# EasyEDA Pro project firefly_solarpanel.eprj

# Schematic Schematic1
Board Name: Board1; Create Date: 2026-03-13; Page Name: P1; Project Name: firefly_solarpanel; Schematic Name: Schematic1; Update Date: 2026-09-25; Company: EasyEDA.com; Page Size: A4; Version: V1.0
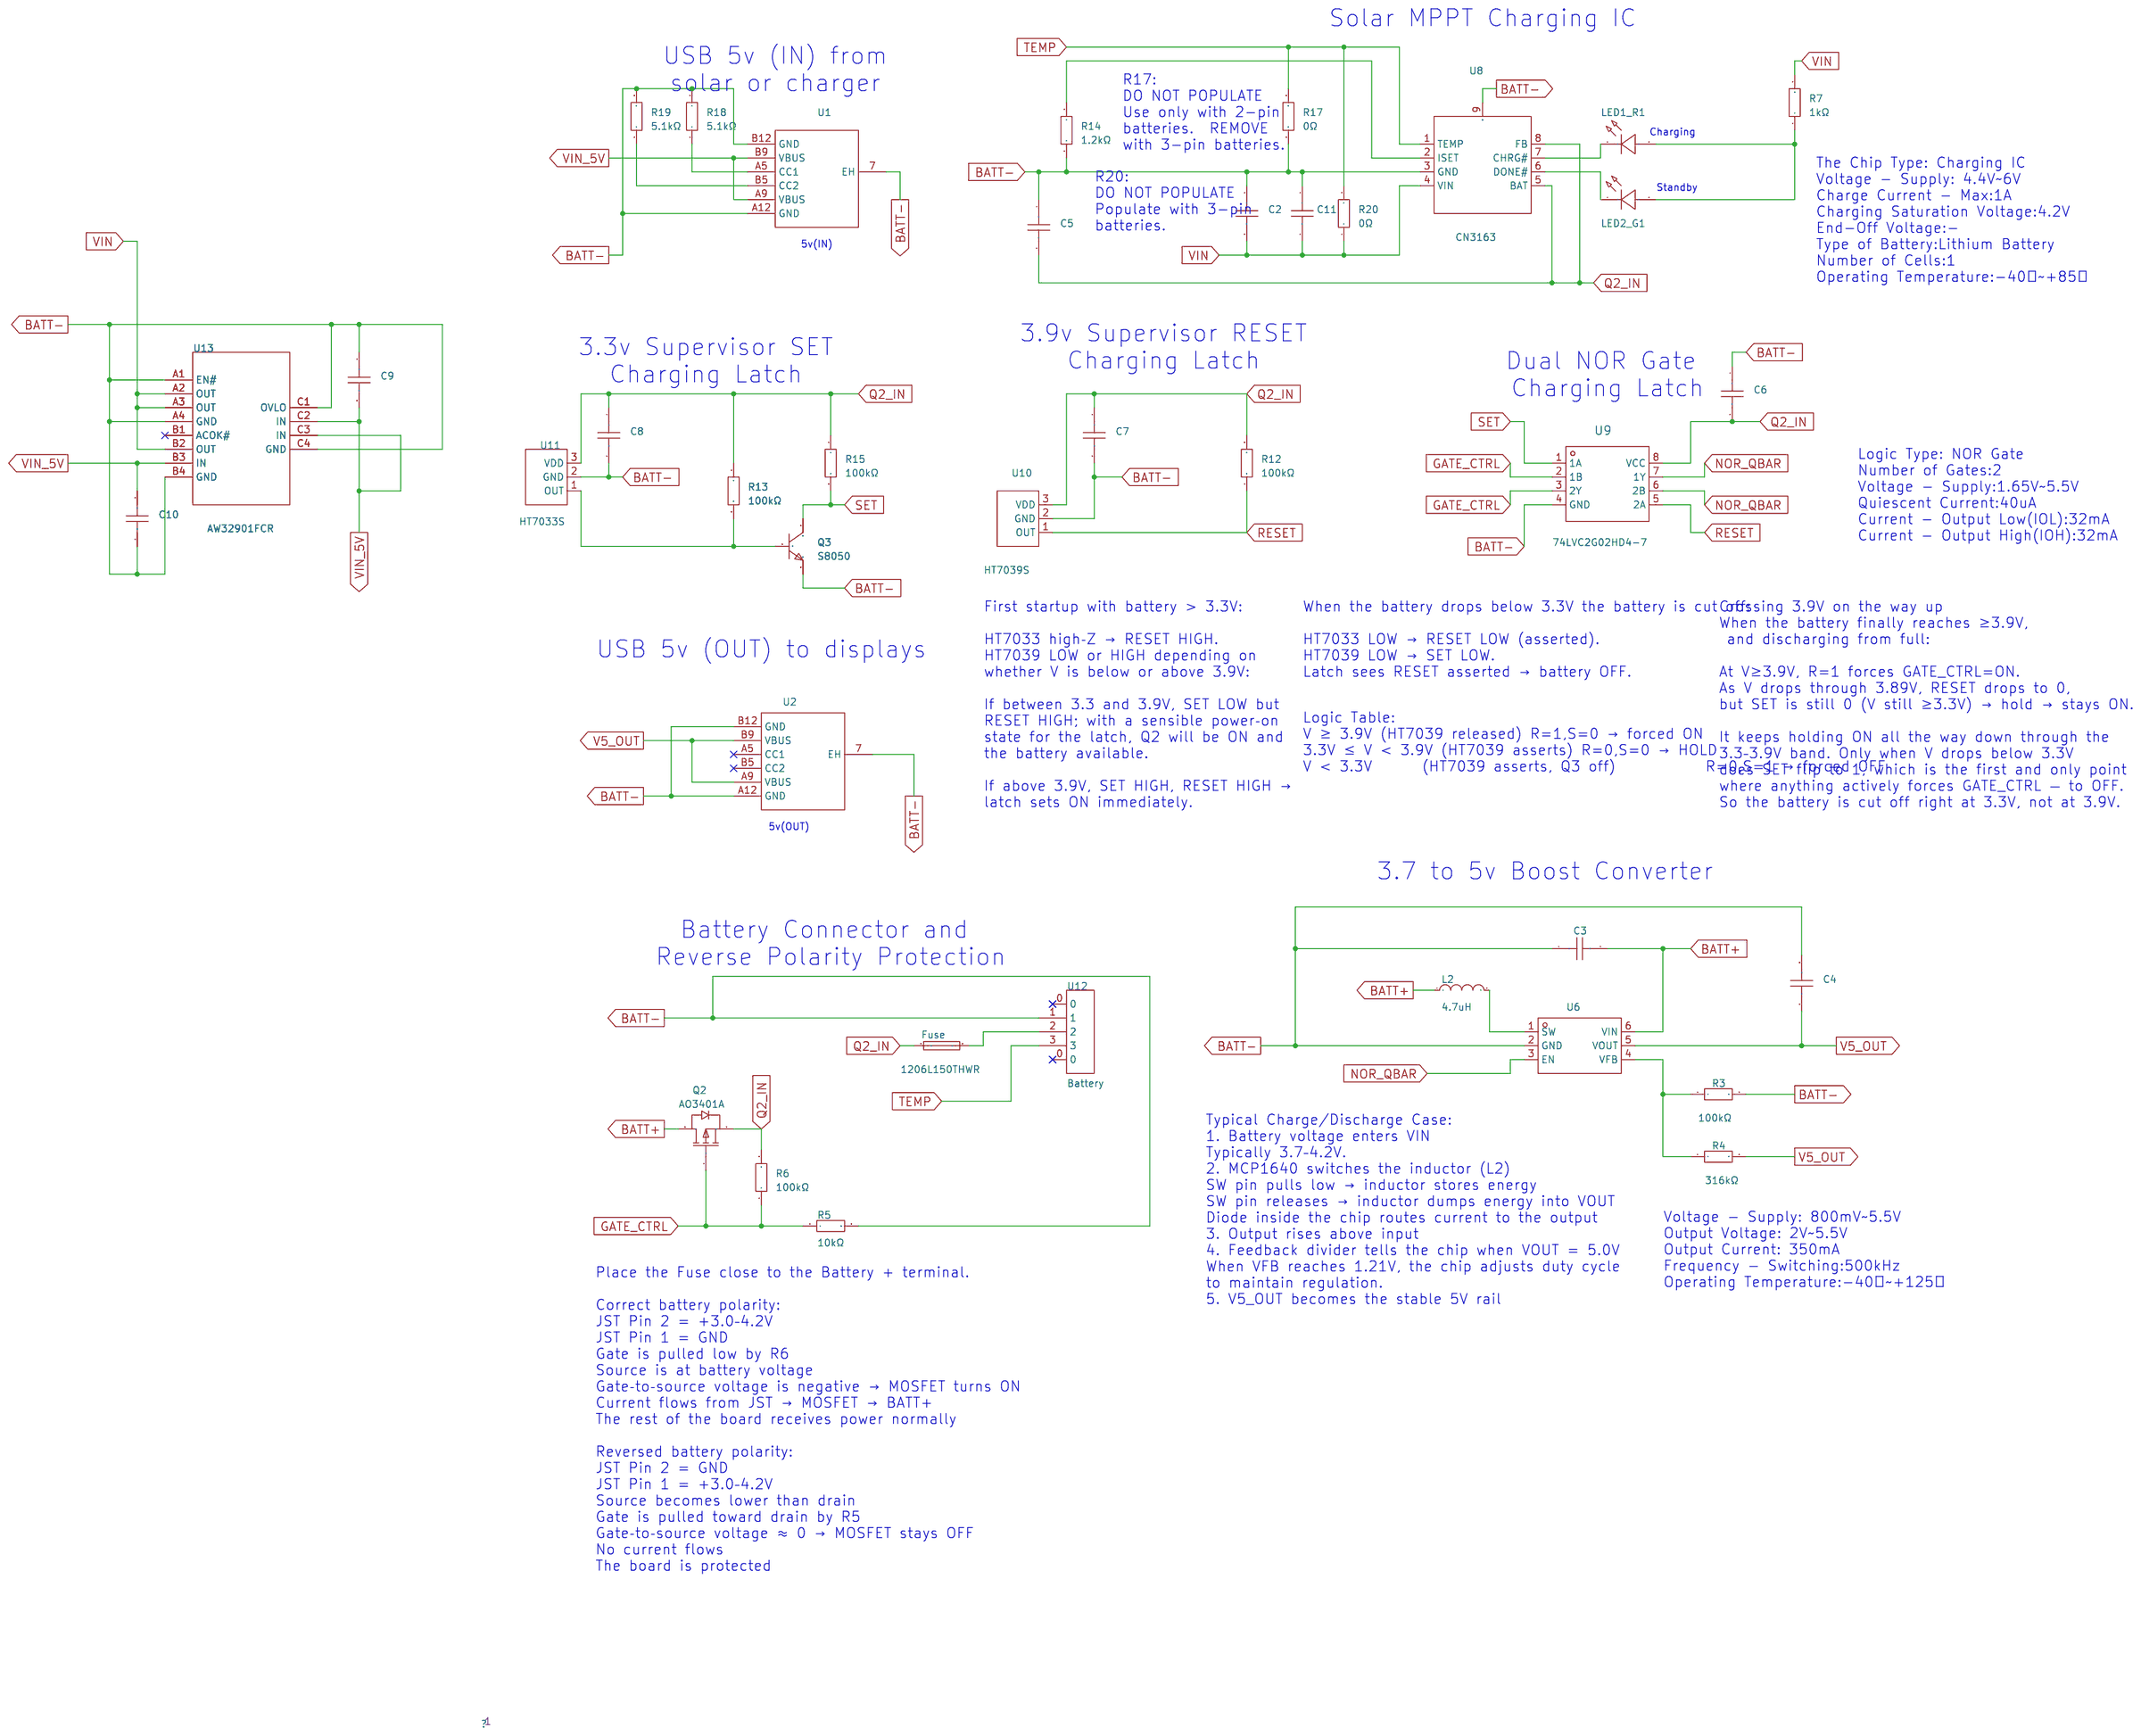
[diagram p0: schematic sheet]

## Parts
C2  1uF  [C0603]
C3  10uF  [C0603]
C4  10uF  [C0603]
C5  1uF  [C0603]
C6  1uF  [C0603]
C7  1uF  [C0603]
C8  1uF  [C0603]
C9  1uF  [C0603]
C10  1uF  [C0603]
C11  1uF  [C0603]
Fuse  1206L150THWR  [F1206]
L2  4.7uH  [L0805]
LED1_R1  XL-1608SURC-06  [LED0603-RD_RED]
LED2_G1  PSC-1608U52GC-G4  [LED0603-RD_GREEN]
Q2  AO3401A  [SOT-23_L2.9-W1.3-P1.90-LS2.4-BR]
Q3  S8050  [SOT-23-3_L2.9-W1.3-P1.90-LS2.4-BR]
R3  100kΩ  [R0603]
R4  316kΩ  [R0603]
R5  10kΩ  [R0603]
R6  100kΩ  [R0603]
R7  1kΩ  [R0603]
R12  100kΩ  [R0603]
R13  100kΩ  [R0603]
R14  1.2kΩ  [R0603]
R15  100kΩ  [R0603]
R17  0Ω  [R0603]
R18  5.1kΩ  [R0603]
R19  5.1kΩ  [R0603]
R20  0Ω  [R0603]  (no BOM)
U1  TYPE-C 6P  [TYPE-C-SMD_TYPE-C-6P_1]
U2  TYPE-C 6P  [TYPE-C-SMD_TYPE-C-6P_1]
U6  MCP1640BT-I/CHY  [SOT-23-6_L2.9-W1.6-P0.95-LS2.8-BR]
U8  CN3163  [ESOP-8_L4.9-W3.9-P1.27-LS6.0-BL-EP]
U9  74LVC2G02HD4-7  [X2-DFN2010-8_L2.0-W1.0-P0.50-BL]
U10  HT7039S  [SOT-23-3_L2.9-W1.6-P1.90-LS2.8-BR]
U11  HT7033S  [SOT-23-3_L2.9-W1.6-P1.90-LS2.8-BR]
U12  Battery  [CONN-SMD_S3B-PH-SM4-TB-LF-SN]
U13  AW32901FCR  [BGA-12_L1.8-W1.3-R3-C4-P0.40-TL]

## Library data of the parts
C2 C5-C11 = CL10A105KO8NNNC: Capacitance:1uF Tolerance:±10% Tolerance:±10% Voltage Rating:16V Temperature Coefficient:X5R; LCSC Part Name: 1uF ±10% 16V; Supplier Part: C1592; Manufacturer: SAMSUNG(三星); Supplier Footprint: 0603; JLCPCB Part Class: Extended Part; Datasheet: https://item.szlcsc.com/datasheet/CL10A105KO8NNNC/1944.html; Supplier: LCSC; Tolerance: ±10%; Voltage Rating: 16V; Temperature Coefficient: X5R
C3 C4 = CL10A106KP8NNNC: Capacitance:10uF Tolerance:±10% Tolerance:±10% Voltage Rating:10V Temperature Coefficient:X5R; LCSC Part Name: 10uF ±10% 10V; Supplier Part: C19702; Manufacturer: SAMSUNG(三星); Supplier Footprint: 0603; JLCPCB Part Class: Basic Part; Datasheet: https://item.szlcsc.com/datasheet/CL10A106KP8NNNC/20411.html; Supplier: LCSC; Tolerance: ±10%; Voltage Rating: 10V; Temperature Coefficient: X5R
Fuse = 1206L150THWR: LCSC Part Name: 8V 1.5A 1206自恢复; Supplier Part: C118413; Manufacturer: Littelfuse(美国力特); Supplier Footprint: 1206; JLCPCB Part Class: Extended Part; Datasheet: https://item.szlcsc.com/datasheet/1206L150THWR/119679.html; Supplier: LCSC; Voltage - Max: 8V; Current - Max: 100A; Hold Current: 1.5A; Trip Current: 3A; Power Dissipation: 800mW; Resistance - Initial (Ri) (Min): 40mΩ; Resistance - Post Trip (R1) (Max): 120mΩ; Time to Trip(Max): 300ms; Operating Temperature: -40℃~+85℃
L2 = CPY201209T-4R7M-NP: Inductance:4.7uH Tolerance:±20% Tolerance:±20% Current Rating:- Current - Saturation (Isat):- DC Resistance(DCR):- Q @ Frequency:- Frequency - Self Resonant:- Ratings:-; LCSC Part Name: 4.7uH ±20%; Supplier Part: C285965; Manufacturer: Chilisin(奇力新); Supplier Footprint: 0805; JLCPCB Part Class: Extended Part; Datasheet: https://item.szlcsc.com/datasheet/CPY201209T-4R7M-NP/271270.html; Supplier: LCSC; Tolerance: ±20%
LED1_R1 = XL-1608SURC-06: Lamp Holder Type:1.6mm x 0.8mm square LED Illumination Color:Red Voltage - Forward(Vf):2.3V Voltage - Forward(Vf):2.3V Power(Watts):50mW Forward Current:20mA Wavelength - Dominant:620nm~630nm Wavelength - Dominant:620nm~630nm Peak Wavelength:625nm Peak Wa; LCSC Part Name: 0603红色贴片式发光二极管; Supplier Part: C965799; Manufacturer: XINGLIGHT(成兴光); Supplier Footprint: 0603; JLCPCB Part Class: Extended Part; Datasheet: https://item.szlcsc.com/datasheet/XL-1608SURC-06/1051408.html; Supplier: LCSC; Lamp Holder Type: 1.6mm x 0.8mm square LED; Illumination Color: Red; Voltage - Forward(Vf): 2.3V; Power(Watts): 50mW; Forward Current: 20mA; Wavelength - Dominant: 620nm~630nm; Peak Wavelength: 625nm; Diode Configuration: Discrete Diode; Lens Color: Water Clear; Luminous Intensity: 225mcd; Viewing Angle: 120°; Mounting Style: Top-mount; Operating Temperature: -40℃~+85℃
LED2_G1 = PSC-1608U52GC-G4: Lamp Holder Type:- Illumination Color:Green Voltage - Forward(Vf):3.1V Voltage - Forward(Vf):3.1V Power(Watts):66mW Forward Current:10mA Wavelength - Dominant:517nm~527nm Wavelength - Dominant:517nm~527nm Peak Wavelength:- Peak Wavelength:- Diode Configur; LCSC Part Name: 钻孔1608低亮绿灯; Supplier Part: C22371297; Manufacturer: HONGLITRONIC(鸿利光电); Supplier Footprint: 0603; JLCPCB Part Class: Extended Part; Datasheet: https://item.szlcsc.com/datasheet/PSC-1608U52GC-G4/23857064.html; Supplier: LCSC; Illumination Color: Green; Voltage - Forward(Vf): 3.1V; Power(Watts): 66mW; Forward Current: 10mA; Wavelength - Dominant: 517nm~527nm; Diode Configuration: Discrete Diode; Lens Color: Water Clear; Luminous Intensity: 780mcd; Viewing Angle: 130°; Operating Temperature: -40℃~+85℃
Q2 = AO3401A_C15127: Number:1 P-Channel Drain to Source Voltage:30V Current - Continuous Drain(Id):4A RDS(on):47mΩ@10V；85mΩ@2.5V；60mΩ@4.5V Pd - Power Dissipation:- Gate Threshold Voltage (Vgs(th)):900mV Gate Charge(Qg):14nC@10V Input Capacitance(Ciss):645pF Reverse Transfer C; LCSC Part Name: 1个P沟道 耐压:30V 电流:4A; Supplier Part: C15127; Manufacturer: AOS; Supplier Footprint: SOT-23; JLCPCB Part Class: Basic Part; Datasheet: https://item.szlcsc.com/datasheet/AO3401A/15801.html; Supplier: LCSC; Number: 1 P-Channel; Drain to Source Voltage: 30V; Current - Continuous Drain(Id): 4A; RDS(on): 47mΩ@10V；85mΩ@2.5V；60mΩ@4.5V; Gate Threshold Voltage (Vgs(th)): 900mV; Gate Charge(Qg): 14nC@10V; Input Capacitance(Ciss): 645pF; Reverse Transfer Capacitance (Crss@Vds): 55pF; Output Capacitance(Coss): 80pF
Q3 = S8050_C51625776: LCSC Part Name: NPN晶体管; Supplier Part: C51625776; Manufacturer: luJing(鲁晶); Supplier Footprint: SOT-23; JLCPCB Part Class: Extended Part; Datasheet: https://item.szlcsc.com/datasheet/S8050/54282507.html; Supplier: LCSC; type: NPN; Current - Collector(Ic): 500mA; Collector - Emitter Voltage VCEO: 25V; Pd - Power Dissipation: 300mW; DC Current Gain: 400; Transition frequency(fT): 150MHz; Current - Collector Cutoff: 100nA; Vce Saturation(VCE(sat)): 600mV; Emitter-Base Voltage(Vebo): 5V; Number: 1 NPN
R3 R6 R12 R13 R15 = CR0603JA0104G: Type:Thick Film Resistors Resistance: Tolerance:±5% Tolerance:±5% Power(Watts): Overload Voltage (Max): Temperature Coefficient:±200ppm/℃ Temperature Coefficient:±200ppm/℃ Operating Temperature Range:-55℃~+125℃ Operating Temperature Range:-55℃~+125℃; LCSC Part Name: 厚膜电阻 100kΩ ±5% 100mW; Supplier Part: C101255; Manufacturer: LIZ(丽智电子); Supplier Footprint: 0603; JLCPCB Part Class: Extended Part; Datasheet: https://atta.szlcsc.com/upload/public/pdf/source/20180403/C189438_6D658388CC7843F35BBC9018D03F0B8E.pdf; Supplier: LCSC; Type: Thick Film Resistors; Tolerance: ±5%; Temperature Coefficient: ±200ppm/℃; Operating Temperature Range: -55℃~+125℃
R4 = 0603WAF3163T5E: Type:Thick Film Resistor Resistance:316kΩ Tolerance:±1% Tolerance:±1% Power(Watts):100mW Voltage-Supply(Max):75V Temperature Coefficient:±100ppm/℃ Temperature Coefficient:±100ppm/℃ Operating Temperature:-55℃~+155℃ Operating Temperature:-55℃~+155℃; LCSC Part Name: 316kΩ ±1% 100mW 厚膜电阻; Supplier Part: C25814; Manufacturer: UNI-ROYAL(厚声); Supplier Footprint: 0603; JLCPCB Part Class: Extended Part; Datasheet: https://item.szlcsc.com/datasheet/0603WAF3163T5E/26557.html; Supplier: LCSC; Type: Thick Film Resistor; Tolerance: ±1%; Power(Watts): 100mW; Voltage-Supply(Max): 75V; Temperature Coefficient: ±100ppm/℃; Operating Temperature: -55℃~+155℃
R5 = HRC0603J103 ENTN: Type:Thick Film Resistor Resistance:10kΩ Tolerance:±5% Tolerance:±5% Power(Watts):100mW Voltage-Supply(Max):50V Temperature Coefficient:±100ppm/℃ Temperature Coefficient:±100ppm/℃ Operating Temperature:-55℃~+155℃ Operating Temperature:-55℃~+155℃; LCSC Part Name: 厚膜电阻; Supplier Part: C54920960; Manufacturer: HC(华橙熊猫); Supplier Footprint: 0603; JLCPCB Part Class: Extended Part; Datasheet: https://item.szlcsc.com/datasheet/HRC0603J103%2520ENTN/58459688.html; Supplier: LCSC; Type: Thick Film Resistor; Tolerance: ±5%; Power(Watts): 100mW; Voltage-Supply(Max): 50V; Temperature Coefficient: ±100ppm/℃; Operating Temperature: -55℃~+155℃
R7 = FRC0603J102 TS: Type:Thick Film Resistor Resistance:1kΩ Tolerance:±5% Tolerance:±5% Power(Watts):100mW Voltage-Supply(Max):75V Temperature Coefficient:±100ppm/℃ Temperature Coefficient:±100ppm/℃ Operating Temperature:-55℃~+155℃ Operating Temperature:-55℃~+155℃; LCSC Part Name: 1kΩ ±5% 100mW 厚膜电阻; Supplier Part: C2907113; Manufacturer: FOJAN(富捷); Supplier Footprint: 0603; JLCPCB Part Class: Extended Part; Datasheet: https://item.szlcsc.com/datasheet/FRC0603J102%2520TS/3180626.html; Supplier: LCSC; Type: Thick Film Resistor; Tolerance: ±5%; Power(Watts): 100mW; Voltage-Supply(Max): 75V; Temperature Coefficient: ±100ppm/℃; Operating Temperature: -55℃~+155℃
R14 = FRC0603J122 TS: Type:Thick Film Resistor Resistance:1.2kΩ Tolerance:±5% Tolerance:±5% Power(Watts):100mW Voltage-Supply(Max):75V Temperature Coefficient:±100ppm/℃ Temperature Coefficient:±100ppm/℃ Operating Temperature:-55℃~+155℃ Operating Temperature:-55℃~+155℃; LCSC Part Name: 1.2kΩ ±5% 100mW 厚膜电阻; Supplier Part: C2907081; Manufacturer: FOJAN(富捷); Supplier Footprint: 0603; JLCPCB Part Class: Extended Part; Supplier: LCSC; Type: Thick Film Resistor; Tolerance: ±5%; Power(Watts): 100mW; Voltage-Supply(Max): 75V; Temperature Coefficient: ±100ppm/℃; Operating Temperature: -55℃~+155℃
R17 R20 = HRC0603J000 ENTN: Type:Thick Film Resistor Resistance:0Ω Tolerance:±5% Tolerance:±5% Power(Watts):100mW Voltage-Supply(Max):50V Temperature Coefficient:±400ppm/℃ Temperature Coefficient:±400ppm/℃ Operating Temperature:-55℃~+155℃ Operating Temperature:-55℃~+155℃; LCSC Part Name: 厚膜电阻 0Ω ±5% 100mW; Supplier Part: C54920957; Manufacturer: HC(华橙熊猫); Supplier Footprint: 0603; JLCPCB Part Class: Extended Part; Datasheet: https://item.szlcsc.com/datasheet/HRC0603J000%2520ENTN/58459685.html; Supplier: LCSC; Type: Thick Film Resistor; Tolerance: ±5%; Power(Watts): 100mW; Voltage-Supply(Max): 50V; Temperature Coefficient: ±400ppm/℃; Operating Temperature: -55℃~+155℃
R18 R19 = 0603WAF5101T5E: Type:Thick Film Resistor Resistance:5.1kΩ Tolerance:±1% Tolerance:±1% Power(Watts):100mW Voltage-Supply(Max):75V Temperature Coefficient:±100ppm/℃ Temperature Coefficient:±100ppm/℃ Operating Temperature:-55℃~+155℃ Operating Temperature:-55℃~+155℃; LCSC Part Name: 厚膜电阻 5.1kΩ ±1%; Supplier Part: C23186; Manufacturer: UNI-ROYAL(厚声); Supplier Footprint: 0603; JLCPCB Part Class: Basic Part; Datasheet: https://item.szlcsc.com/datasheet/0603WAF5101T5E/23913.html; Supplier: LCSC; Type: Thick Film Resistor; Tolerance: ±1%; Power(Watts): 100mW; Voltage-Supply(Max): 75V; Temperature Coefficient: ±100ppm/℃; Operating Temperature: -55℃~+155℃
U1 U2 = TYPE-C 6P: Connector Type:Type-C Protocol Standard:- Gender:Female Mounting Type:Surface Mount, Right Angle Number of Contacts:6P Number of Ports:1 Current Rating-Power:3A Voltage Rating:5V Connect-Disconnect Life:3,000 Cycles Supplementary Features:- Center Height:; LCSC Part Name: 6P卧贴母座; Supplier Part: C456012; Manufacturer: SHOU HAN(首韩); Supplier Footprint: SMD; JLCPCB Part Class: Extended Part; Datasheet: https://item.szlcsc.com/datasheet/TYPE-C%25206P/458819.html; Supplier: LCSC; Connector Type: Type-C; Gender: Female; Mounting Type: Surface Mount, Right Angle; Number of Contacts: 6P; Number of Ports: 1; Current Rating-Power: 3A; Voltage Rating: 5V; Connect-Disconnect Life: 3,000 Cycles; Detection color: Black; Operating Temperature: -40℃~+85℃
U6 = MCP1640BT-I/CHY: LCSC Part Name: 升压型 350mA 800mV~5.5V; Supplier Part: C478087; Manufacturer: MICROCHIP(美国微芯); Supplier Footprint: SOT-23-6; JLCPCB Part Class: Extended Part; Datasheet: https://item.szlcsc.com/datasheet/MCP1640BT-I%252FCHY/485396.html; Supplier: LCSC; Function: Boost; Voltage - Supply: 800mV~5.5V; Output Voltage: 2V~5.5V; Output Current: 350mA; Frequency - Switching: 500kHz; Operating Temperature: -40℃~+125℃@(TJ); Synchronous Rectifier: Yes; Number of Outputs: 1; Topology: Boost; Quiescent Current: 19uA; Switch tube (built-in/external): Built-in; Output Type: Adjustable; Features: Light load efficient mode；Overcurrent Protection；Load disconnect
U8 = CN3163: LCSC Part Name: 可用太阳能板供电的锂电池充电管理芯片; Supplier Part: C559031; Manufacturer: CONSONANCE(上海如韵); Supplier Footprint: ESOP-8; JLCPCB Part Class: Extended Part; Datasheet: https://item.szlcsc.com/datasheet/CN3163/582671.html; Supplier: LCSC; The Chip Type: Charging IC; Voltage - Supply: 4.4V~6V; Charge Current - Max: 1A; Charging Saturation Voltage: 4.2V; Type of Battery: Lithium Battery; Number of Cells: 1; Operating Temperature: -40℃~+85℃; Battery Temperature Detection: Support; Supply Current (Iq): 3uA
U9 = 74LVC2G02HD4-7: Logic Type:NOR Gate Number of Channels:2 Voltage - Supply:1.65V~5.5V Voltage - Supply:1.65V~5.5V Quiescent Current:40uA Current - Output Low(IOL):32mA Current - Output High(IOH):32mA Input Logic Level - High:- Input Logic Level - High:- Input Logic Level; LCSC Part Name: 双2输入或非门; Supplier Part: C842640; Manufacturer: DIODES(美台); Supplier Footprint: X2-DFN2010-8; JLCPCB Part Class: Extended Part; Datasheet: https://item.szlcsc.com/datasheet/74LVC2G02HD4-7/900971.html; Supplier: LCSC; Logic Type: NOR Gate; Number of Channels: 2; Voltage - Supply: 1.65V~5.5V; Quiescent Current: 40uA; Current - Output Low(IOL): 32mA; Current - Output High(IOH): 32mA; Series: 74LVC Series; Propagation Delay: 5.5ns@5V,50pF; Operating Temperature: -40℃~+125℃; Input Number: 2; Features: Local shutdown mode
U10 = HT7039S: LCSC Part Name: 三端口低压检测器; Supplier Part: C2842952; Manufacturer: UMW(友台半导体); Supplier Footprint: SOT-23; JLCPCB Part Class: Extended Part; Datasheet: https://item.szlcsc.com/datasheet/HT7039S/3029320.html; Supplier: LCSC; ChipType: Voltage Detector; Output Type: Open Drain; Voltage - Supply: 1.5V~12V; Reset Active Level: Active Low; Threshold Voltage: 3.9V; Number of Voltages Monitored: 1; Manual Reset: No; Watchdog: No; Operating Temperature: -40℃~+85℃; Quiescent Current: 2uA
U11 = HT7033S: LCSC Part Name: 低电压检测器; Supplier Part: C2842951; Manufacturer: UMW(友台半导体); Supplier Footprint: SOT-23; JLCPCB Part Class: Extended Part; Datasheet: https://item.szlcsc.com/datasheet/HT7033S/3029319.html; Supplier: LCSC; ChipType: Voltage Detector; Output Type: Open-drain; Voltage - Supply: 1.5V~12V; Reset Active Level: Active Low; Threshold Voltage: 3.3V; Number of Voltages Monitored: 1; Operating Temperature: -40℃~+85℃; Quiescent Current: 2uA
U12 = S3B-PH-SM4-TB(LF)(SN): LCSC Part Name: 1x3P 间距:2mm 卧贴 系列:PH; Supplier Part: C265101; Manufacturer: JST; Supplier Footprint: SMD,P=2mm,卧贴; JLCPCB Part Class: Extended Part; Datasheet: https://item.szlcsc.com/datasheet/S3B-PH-SM4-TB(LF)(SN)/255472.html; Supplier: LCSC; Pins Structure: 1x3P; Pitch: 2mm; Mounting Type: Surface Mount, Right Angle; Reference Series: PH; Number of Pins: 3P; Number of Rows: 1; Number of PINs Per Row: 3; Current Rating: 2A; Contact Material: Copper Alloy; Contact Plating: Tin; Operating Temperature: -25℃~+85℃; Voltage Rating: 100V; Plastic Material: PA; Flame Retardant Rating: UL94V-0; Supplementary Features: Auxiliary Solder Pin; Color: Beige; Z-Height of the Board: 5.5mm; X-Length of Bottom Edge on Board (Spacing Line): 9.9mm; Y-Width of Bottom Edge on Board: 8.6mm
U13 = AW32901FCR: LCSC Part Name: 具备浪涌保护功能的过压保护负载开关; Supplier Part: C407920; Manufacturer: AWINIC(艾为); Supplier Footprint: FCQFN-12(1.3x1.8); JLCPCB Part Class: Extended Part; Datasheet: https://item.szlcsc.com/datasheet/AW32901FCR/397020.html; Supplier: LCSC; Type: Load Switch; Number of Channels: 1; Control Input Logic: Active Low; Voltage - Supply: 3V~28V; Maximum Continuous Current: 5A; RDS(on): 27mΩ; Features: Over temperature protection；Overvoltage protection；Under-voltage lockout；Integrated charge pump；Output discharge function; Operating Temperature	-: -40℃~+85℃

## Nets
V5_OUT: C4.1 R4.2 U2.A9(VBUS) U2.B9(VBUS) U6.5(VOUT)
VIN: C2.2 C11.2 R7.2 R20.1 U8.4(VIN) U13.A2(OUT) U13.A3(OUT) U13.B2(OUT)
VIN_5V: C9.2 C10.1 U1.A9(VBUS) U1.B9(VBUS) U13.B3(IN) U13.C2(IN) U13.C3(IN)
BATT+: C3.2 L2.1 Q2.3(D) U6.6(VIN)
BATT-: C2.1 C3.1 C4.2 C5.1 C6.1 C7.2 C8.2 C9.1 C10.2 C11.1 Q3.2(E) R3.2 R5.2 R14.1 R17.1 R18.2 R19.2 U1.7(EH) U1.A12(GND) U1.B12(GND) U2.7(EH) U2.A12(GND) U2.B12(GND) U6.2(GND) U8.3(GND) U8.9(PAD) U9.4(GND) U10.2(GND) U11.2(GND) U12.1 U13.A1(EN#) U13.A4(GND) U13.B4(GND) U13.C1(OVLO) U13.C4(GND)
GATE_CTRL: Q2.1(G) R5.1 R6.1 U9.2(1B) U9.3(2Y)
NOR_QBAR: U6.3(EN) U9.6(2B) U9.7(1Y)
Q2_IN: C5.2 C6.2 C7.1 C8.1 Fuse.1 Q2.2(S) R6.2 R12.2 R13.1 R15.1 U8.5(BAT) U8.8(FB) U9.8(VCC) U10.3(VDD) U11.3(VDD)
RESET: R12.1 U9.5(2A) U10.1(OUT)
SET: Q3.3(C) R15.2 U9.1(1A)
TEMP: R17.2 R20.2 U8.1(TEMP) U12.3
$1N3839: L2.2 U6.1(SW)
$1N3841: R3.1 R4.1 U6.4(VFB)
$1N4559: Fuse.2 U12.2
$1N8262: LED2_G1.1(K) U8.6(DONE#)
$1N12165: LED1_R1.1(K) U8.7(CHRG#)
$1N12177: LED1_R1.2(A) LED2_G1.2(A) R7.1
$1N16095: Q3.1(B) R13.2 U11.1(OUT)
$1N17264: R14.2 U8.2(ISET)
$1N25253: R18.1 U1.A5(CC1)
$1N25293: R19.1 U1.B5(CC2)

Not connected (* = marked no-connect by the designer): U2 A5(CC1)* B5(CC2)*; U12 0*; U13 B1(ACOK#)*

## Notes on the sheet
- Solar MPPT Charging IC
- USB 5v (IN) from
  solar or charger
- R17:
  DO NOT POPULATE
  Use only with 2-pin
  batteries.  REMOVE
  with 3-pin batteries.
- Charging
- The Chip Type: Charging IC
  Voltage - Supply: 4.4V~6V
  Charge Current - Max:1A
  Charging Saturation Voltage:4.2V
  End-Off Voltage:-
  Type of Battery:Lithium Battery
  Number of Cells:1
  Operating Temperature:-40℃~+85℃
- R20:
  DO NOT POPULATE
  Populate with 3-pin
  batteries.
- Standby
- 5v(IN)
- 3.9v Supervisor RESET
  Charging Latch
- 3.3v Supervisor SET
  Charging Latch
- Dual NOR Gate
  Charging Latch
- Logic Type: NOR Gate
  Number of Gates:2
  Voltage - Supply:1.65V~5.5V
  Quiescent Current:40uA
  Current - Output Low(IOL):32mA
  Current - Output High(IOH):32mA
- First startup with battery > 3.3 V:
  HT7033 high‑Z → RESET HIGH.
  HT7039 LOW or HIGH depending on
  whether V is below or above 3.9 V:
  If between 3.3 and 3.9 V, SET LOW but
  RESET HIGH; with a sensible power‑on
  state for the latch, Q2 will be ON and
  the battery available.
  If above 3.9 V, SET HIGH, RESET HIGH →
  latch sets ON immediately.
- When the battery drops below 3.3 V the battery is cut off:
  HT7033 LOW → RESET LOW (asserted).
  HT7039 LOW → SET LOW.
  Latch sees RESET asserted → battery OFF.
- Crossing 3.9 V on the way up
  When the battery finally reaches ≥3.9 V,
   and discharging from full:
  At V≥3.9V, R=1 forces GATE_CTRL=ON.
  As V drops through 3.89V, RESET drops to 0,
  but SET is still 0 (V still ≥3.3V) → hold → stays ON.
  It keeps holding ON all the way down through the
  3.3–3.9V band. Only when V drops below 3.3V
  does SET flip to 1, which is the first and only point
  where anything actively forces GATE_CTRL — to OFF.
  So the battery is cut off right at 3.3V, not at 3.9V.
- USB 5v (OUT) to displays
- Logic Table:
  V ≥ 3.9V (HT7039 released) R=1,S=0 → forced ON
  3.3V ≤ V < 3.9V (HT7039 asserts) R=0,S=0 → HOLD
  V < 3.3V	(HT7039 asserts, Q3 off)	R=0,S=1 → forced OFF
- 5v(OUT)
- 3.7 to 5v Boost Converter
- Battery Connector and
  Reverse Polarity Protection
- Typical Charge/Discharge Case:
  1. Battery voltage enters VIN
  Typically 3.7–4.2 V.
  2. MCP1640 switches the inductor (L2)
  SW pin pulls low → inductor stores energy
  SW pin releases → inductor dumps energy into VOUT
  Diode inside the chip routes current to the output
  3. Output rises above input
  4. Feedback divider tells the chip when VOUT = 5.0 V
  When VFB reaches 1.21 V, the chip adjusts duty cycle
  to maintain regulation.
  5. V5_OUT becomes the stable 5 V rail
- Voltage - Supply: 800mV~5.5V
  Output Voltage: 2V~5.5V
  Output Current: 350mA
  Frequency - Switching:500kHz
  Operating Temperature:-40℃~+125℃
- Place the Fuse close to the Battery + terminal.
  Correct battery polarity:
  JST Pin 2 = +3.0–4.2 V
  JST Pin 1 = GND
  Gate is pulled low by R6
  Source is at battery voltage
  Gate‑to‑source voltage is negative → MOSFET turns ON
  Current flows from JST → MOSFET → BATT+
  The rest of the board receives power normally
  Reversed battery polarity:
  JST Pin 2 = GND
  JST Pin 1 = +3.0–4.2 V
  Source becomes lower than drain
  Gate is pulled toward drain by R5
  Gate‑to‑source voltage ≈ 0 → MOSFET stays OFF
  No current flows
  The board is protected

# Schematic Schematic2
Board Name: test-jig; Create Date: 2026-08-29; Page Name: P1; Project Name: firefly_solarpanel; Schematic Name: Schematic2; Update Date: 2026-09-02; Company: EasyEDA.com; Page Size: A4; Version: V1.0
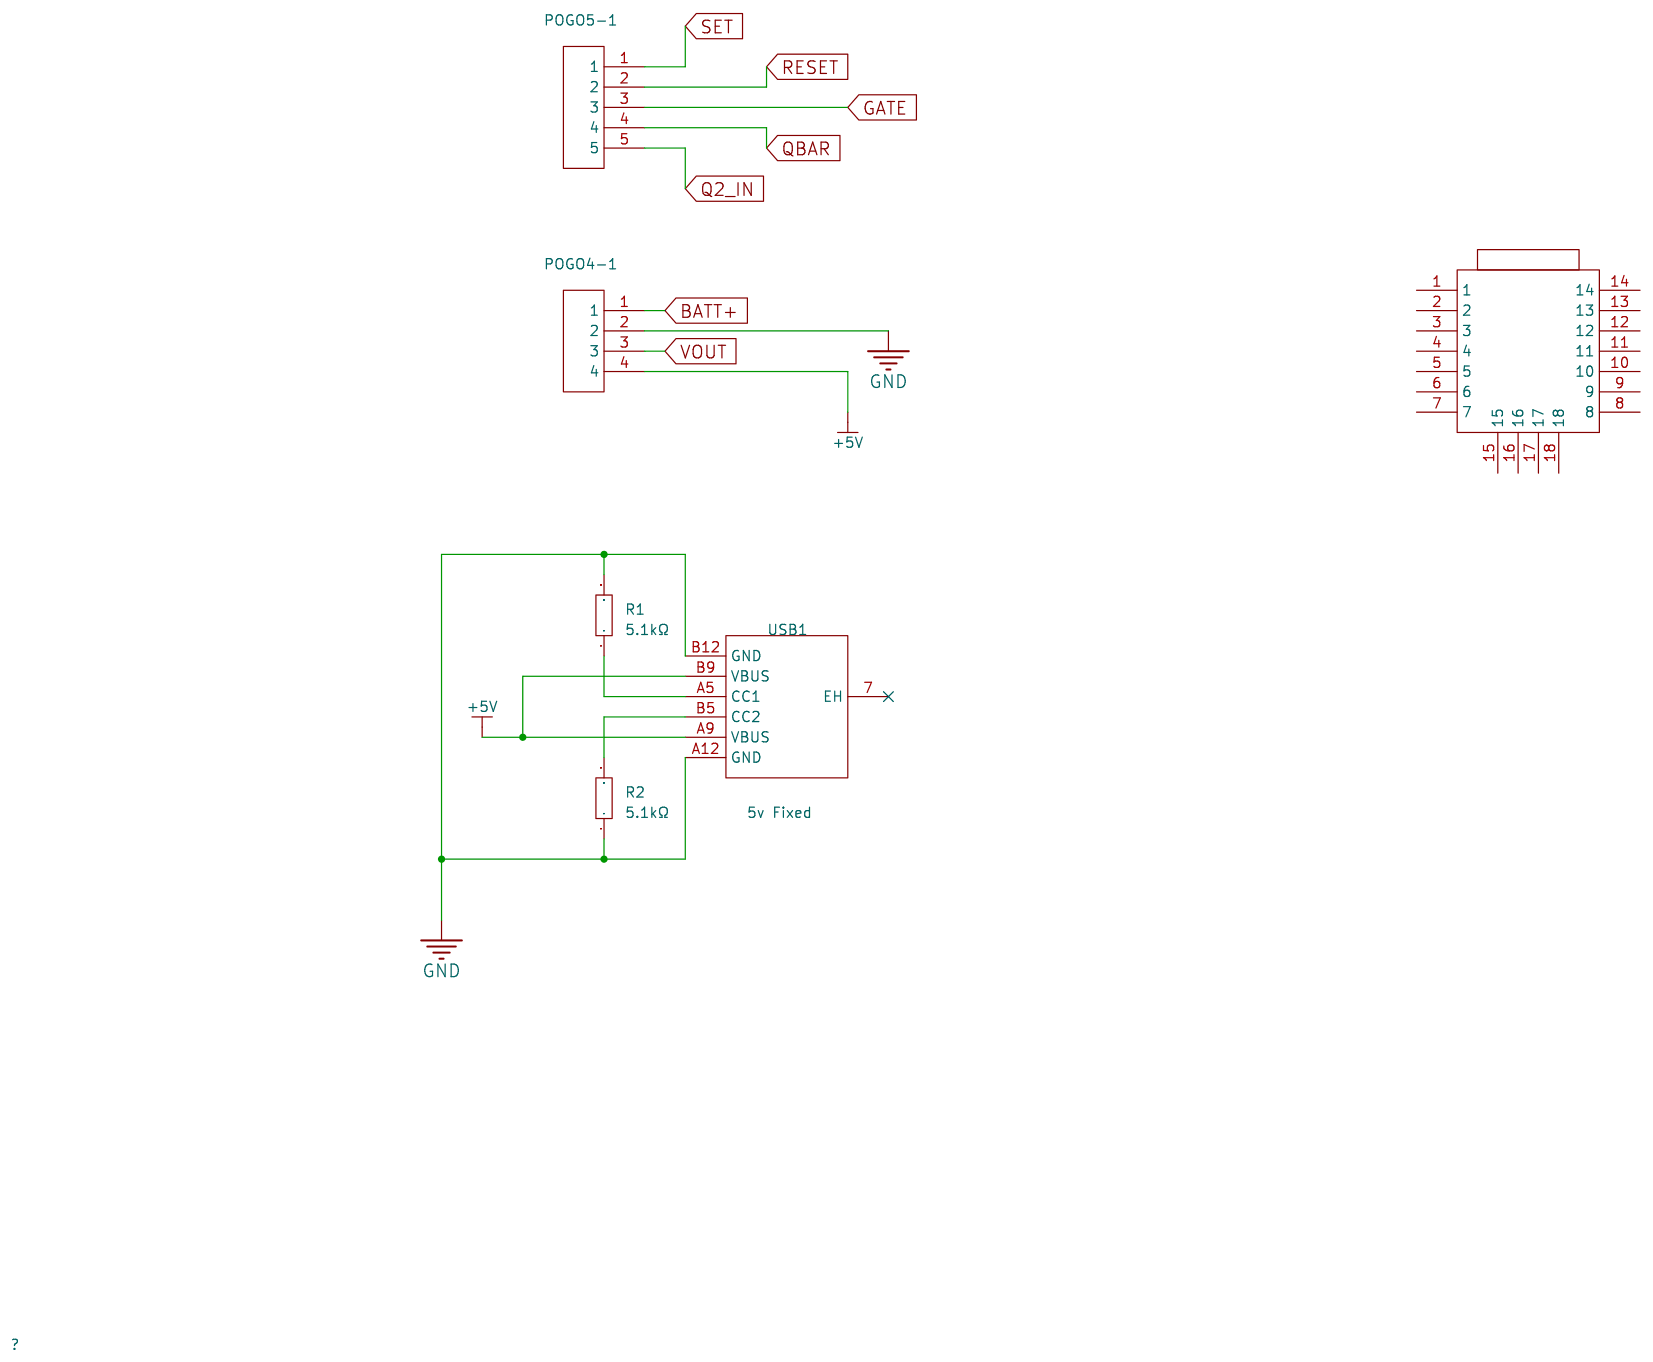
[diagram p1: schematic sheet]

## Parts
MP1  -  [XIAO-RP2040-SMD]
POGO4-1  -  [4-pin Pogo]
POGO5-1  -  [5-pin Pogo]
R1  5.1kΩ  [R0805]
R2  5.1kΩ  [R0805]
USB1  5v Fixed  [TYPE-C-SMD_TYPE-C-6P_1]

## Library data of the parts
MP1 = xiao_rp2040
POGO4-1 = 4-pin Pogo
POGO5-1 = 5-pin Pogo
R1 R2 = HRC0805J512 FNTN: Type:Thick Film Resistor Resistance:5.1kΩ Tolerance:±5% Tolerance:±5% Power(Watts):125mW Voltage-Supply(Max):150V Temperature Coefficient:±100ppm/℃ Temperature Coefficient:±100ppm/℃ Operating Temperature:-55℃~+155℃ Operating Temperature:-55℃~+155℃; LCSC Part Name: 厚膜电阻 5.1kΩ ±5% 125mW; Supplier Part: C55098669; Manufacturer: HC(华橙熊猫); Supplier Footprint: 0805; JLCPCB Part Class: Extended Part; Datasheet: https://item.szlcsc.com/datasheet/HRC0805J512%2520FNTN/58769980.html; Supplier: LCSC; Type: Thick Film Resistor; Tolerance: ±5%; Power(Watts): 125mW; Voltage-Supply(Max): 150V; Temperature Coefficient: ±100ppm/℃; Operating Temperature: -55℃~+155℃
USB1 = TYPE-C 6P: Connector Type:Type-C Protocol Standard:- Gender:Female Mounting Type:Surface Mount, Right Angle Number of Contacts:6P Number of Ports:1 Current Rating-Power:3A Voltage Rating:5V Connect-Disconnect Life:3,000 Cycles Supplementary Features:- Center Height:; LCSC Part Name: 6P卧贴母座; Supplier Part: C456012; Manufacturer: SHOU HAN(首韩); Supplier Footprint: SMD; JLCPCB Part Class: Extended Part; Datasheet: https://item.szlcsc.com/datasheet/TYPE-C%25206P/458819.html; Supplier: LCSC; Connector Type: Type-C; Gender: Female; Mounting Type: Surface Mount, Right Angle; Number of Contacts: 6P; Number of Ports: 1; Current Rating-Power: 3A; Voltage Rating: 5V; Connect-Disconnect Life: 3,000 Cycles; Detection color: Black; Operating Temperature: -40℃~+85℃

## Nets
+5V: POGO4-1.4 USB1.A9(VBUS) USB1.B9(VBUS)
GND: POGO4-1.2 R1.2 R2.1 USB1.A12(GND) USB1.B12(GND)
BATT+: POGO4-1.1
GATE: POGO5-1.3
Q2_IN: POGO5-1.5
QBAR: POGO5-1.4
RESET: POGO5-1.2
SET: POGO5-1.1
VOUT: POGO4-1.3
Net-(R1-1): R1.1 USB1.A5(CC1)
Net-(R2-2): R2.2 USB1.B5(CC2)

Not connected (* = marked no-connect by the designer): MP1 1 2 3 4 5 6 7 8 9 10 11 12 13 14 15 16 17 18; USB1 7(EH)*

# Board PCB2
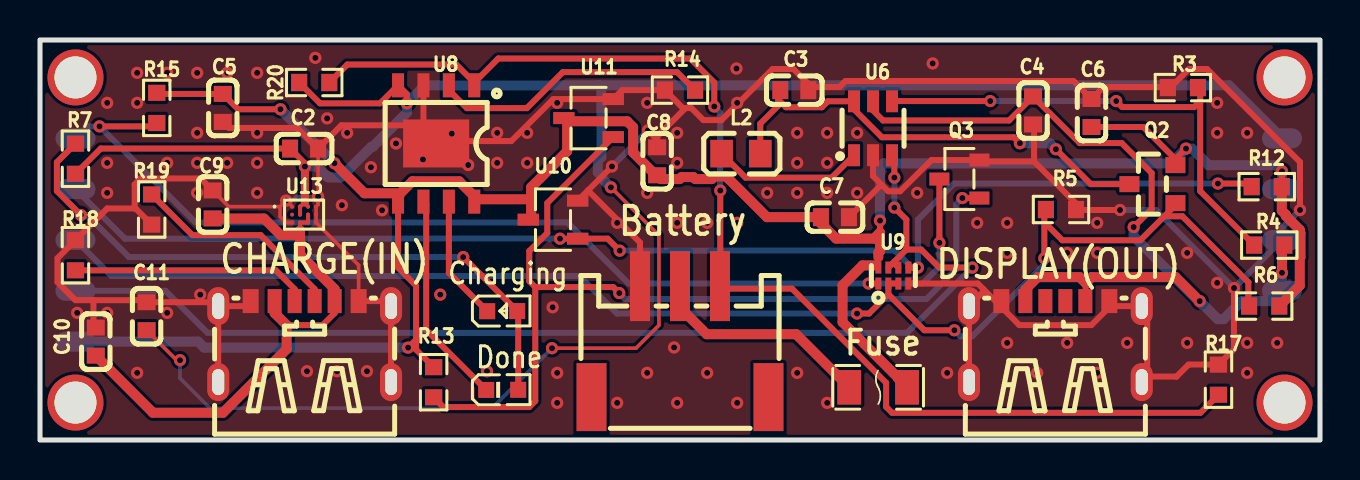
[diagram p2: board, top side]
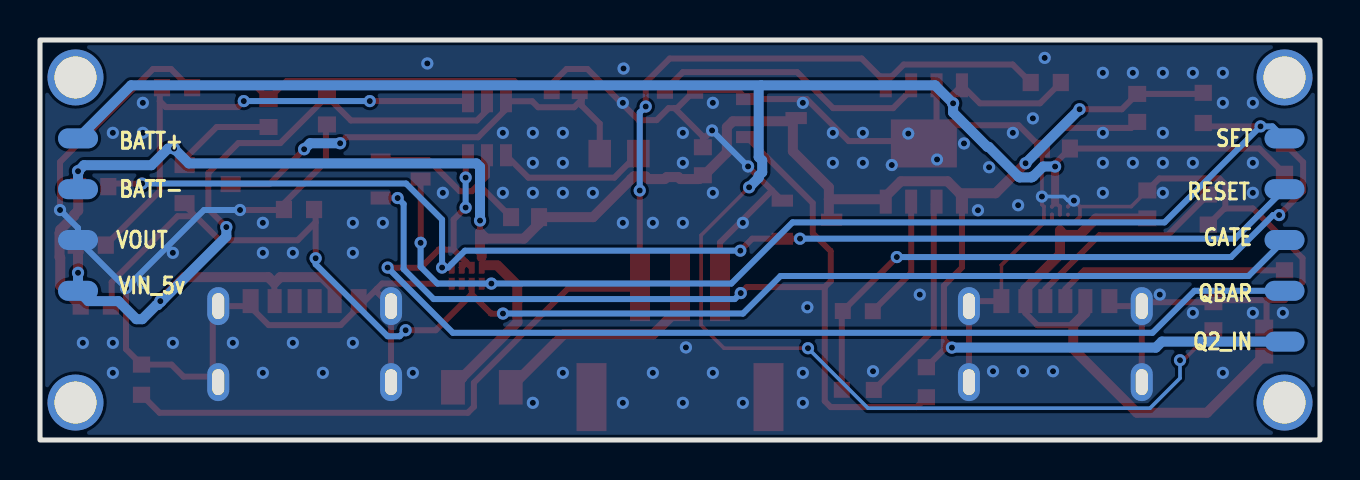
[diagram p3: board, bottom side, seen from below]

Outline 64 x 20 mm; copper layers: Top Layer, Bottom Layer. Coordinates in mm from the lower left corner of the outline.
Outline path: rectangle 0,20 64,0
Stack: Top Layer 0.035mm / Dielectric1 1.51mm FR4 er 4.5 / Bottom Layer 0.035mm

## Design rules (mm)
template: Custom Config
spacing copperThickness1oz (default): track to track 0.2, other pairs 0.152 to 0.3
spacing copperThickness2oz: track to track 0.102, other pairs 0.152 to 0.3
track width copperThickness1oz (default): min 0.127, default 0.3, max 2.54
track width copperThickness2oz: min 0.4, default 0.4, max 2.54
differential pair differentialPair (default): width min 0.127, default 0.254, max 2.54; gap min 0.152, default 0.152
via viaSize (default): diameter min 0.5, default 0.61, max 10; hole min 0.3, default 0.305, max 6.3

## Placement (name value [footprint] x y rotation side)
C2  1uF  [C0603]  13.2 14.57 180 top
C3  10uF  [C0603]  37.72 17.49 180 top
C4  10uF  [C0603]  49.65 16.48 270 top
C5  1uF  [C0603]  9.14 16.6 90 top
C6  1uF  [C0603]  52.57 16.35 270 top
C7  1uF  [C0603]  39.75 11.14 0 top
C8  1uF  [C0603]  30.86 13.94 90 top
C9  1uF  [C0603]  8.63 11.78 270 top
C10  1uF  [C0603]  2.79 4.92 90 top
C11  1uF  [C0603]  5.33 6.19 270 top
Fuse  1206L150THWR  [F1206]  41.91 2.63 180 top
L2  4.7uH  [L0805]  35.05 14.32 180 top
LED1_R1  XL-1608SURC-06  [LED0603-RD_RED]  23.11 6.44 0 top
LED2_G1  PSC-1608U52GC-G4  [LED0603-RD_GREEN]  23.11 2.51 0 top
NOREF  -  [Pad_e40607]  1.77 12.54 0 top
NOREF#2  -  [Pad_e20]  1.77 18.13 0 top
NOREF#3  -  [Pad_e22]  62.23 18.13 0 top
NOREF#4  -  [Pad_e3693]  62.1 15.08 0 top
NOREF#5  -  [Pad_e26]  62.23 1.87 0 top
NOREF#6  -  [Pad_e7358]  62.1 7.46 0 top
NOREF#7  -  [Pad_e3698]  62.1 10 0 top
NOREF#8  -  [Pad_e40606]  1.77 15.08 0 top
NOREF#9  -  [Pad_e34688]  1.77 4.92 0 top
NOREF#10  -  [Pad_e40611]  1.77 10 0 top
NOREF#11  -  [Pad_e34683]  1.77 7.46 0 top
NOREF#12  -  [Pad_e23]  1.77 1.87 0 top
NOREF#13  -  [Pad_e3695]  62.1 12.54 0 top
Q2  AO3401A  [SOT-23_L2.9-W1.3-P1.90-LS2.4-BR]  55.62 12.79 0 top
Q3  S8050  [SOT-23-3_L2.9-W1.3-P1.90-LS2.4-BR]  45.97 13.05 0 top
R3  100kΩ  [R0603]  57.15 17.62 180 top
R4  316kΩ  [R0603]  61.46 9.75 0 top
R5  10kΩ  [R0603]  51.05 11.52 0 top
R6  100kΩ  [R0603]  61.21 6.7 0 top
R7  1kΩ  [R0603]  1.77 14.06 270 top
R12  100kΩ  [R0603]  61.34 12.67 0 top
R13  100kΩ  [R0603]  19.68 2.89 270 top
R14  1.2kΩ  [R0603]  32 17.49 0 top
R15  100kΩ  [R0603]  5.84 16.6 270 top
R17  0Ω  [R0603]  58.92 3.02 270 top
R18  5.1kΩ  [R0603]  1.77 9.24 90 top
R19  5.1kΩ  [R0603]  5.58 11.52 270 top
R20  0Ω  [R0603]  13.71 17.87 0 top
U1  TYPE-C 6P  [TYPE-C-SMD_TYPE-C-6P_1]  13.23 4.92 0 top
U2  TYPE-C 6P  [TYPE-C-SMD_TYPE-C-6P_1]  50.77 4.92 0 top
U6  MCP1640BT-I/CHY  [SOT-23-6_L2.9-W1.6-P0.95-LS2.8-BR]  41.65 15.59 270 top
U8  CN3163  [ESOP-8_L4.9-W3.9-P1.27-LS6.0-BL-EP]  19.81 14.83 180 top
U9  74LVC2G02HD4-7  [X2-DFN2010-8_L2.0-W1.0-P0.50-BL]  42.67 8.22 0 top
U10  HT7039S  [SOT-23-3_L2.9-W1.6-P1.90-LS2.8-BR]  25.65 11.02 0 top
U11  HT7033S  [SOT-23-3_L2.9-W1.6-P1.90-LS2.8-BR]  27.43 16.1 0 top
U12  Battery  [CONN-SMD_S3B-PH-SM4-TB-LF-SN]  32 4.92 180 top
U13  AW32901FCR  [BGA-12_L1.8-W1.3-R3-C4-P0.40-TL]  13.2 11.27 0 top

## Footprints (pads in the part's own frame, mm; a bottom-side part is the same pattern mirrored in y, then rotated)
BGA-12_L1.8-W1.3-R3-C4-P0.40-TL
  round 0.2 smd: A1(-0.6,0.4) A2(-0.2,0.4) A3(0.2,0.4) A4(0.6,0.4) B1(-0.6,0) B2(-0.2,0) B3(0.2,0) B4(0.6,0) C1(-0.6,-0.4) C2(-0.2,-0.4) C3(0.2,-0.4) C4(0.6,-0.4)
C0603
  rect 0.8x0.9 smd: 1(-0.7,0) 2(0.7,0)
CONN-SMD_S3B-PH-SM4-TB-LF-SN
  rect 1.5x3.4 smd: 0(-4.425,2.775) 0(4.425,2.775)
  rect 1x3.5 smd: 1(2,-2.775) 2(0,-2.775) 3(-2,-2.775)
ESOP-8_L4.9-W3.9-P1.27-LS6.0-BL-EP
  rect 0.6x1.2 smd: 1(-1.905,-2.909) 2(-0.635,-2.909) 3(0.635,-2.909) 4(1.905,-2.909) 5(1.905,2.909) 6(0.635,2.909) 7(-0.635,2.909) 8(-1.905,2.909)
  rect 3.3x2.4 smd: 9(0,0)
F1206
  rect 1.19x1.728 smd: 1(-1.445,0) 2(1.445,0)
L0805
  rect 1.133x1.377 smd: 1(-0.966,0) 2(0.966,0)
LED0603-RD_GREEN
  rect 0.8x0.8 smd: 1(-0.799,-0.004) 2(0.799,0.004)
LED0603-RD_RED
  rect 0.8x0.8 smd: 1(-0.749,-0.004) 2(0.749,0.004)
Pad_e20
  round 2.8 hole 2.1: 1(0,0)
Pad_e22
  round 2.8 hole 2.1: 2(0,0)
Pad_e23
  round 2.8 hole 2.1: 3(0,0)
Pad_e26
  round 2.8 hole 2.1: 4(0,0)
Pad_e3693
  oval 2x1 smd far side: TP1(0,0)
Pad_e3695
  oval 2x1 smd far side: TP2(0,0)
Pad_e3698
  oval 2x1 smd far side: TP4(0,0)
Pad_e7358
  oval 2x1 smd far side: TP5(0,0)
Pad_e34683
  oval 2x1 smd far side: TP1(0,0)
Pad_e34688
  oval 2x1 smd far side: TP5(0,0)
Pad_e40606
  oval 2x1 smd far side: TP1(0,0)
Pad_e40607
  oval 2x1 smd far side: TP2(0,0)
Pad_e40611
  oval 2x1 smd far side: TP2(0,0)
R0603
  rect 0.806x0.864 smd: 1(-0.753,0) 2(0.753,0)
SOT-23-3_L2.9-W1.3-P1.90-LS2.4-BR
  rect 1x0.65 smd: 1(1,-0.95) 2(1,0.95) 3(-1,0)
SOT-23-3_L2.9-W1.6-P1.90-LS2.8-BR
  rect 1.07x0.6 smd: 1(1.235,-0.95) 2(1.235,0.95) 3(-1.235,0)
SOT-23-6_L2.9-W1.6-P0.95-LS2.8-BR
  rect 1.1x0.6 smd: 1(1.35,-0.95) 2(1.35,0) 3(1.35,0.95) 4(-1.35,0.95) 5(-1.35,0) 6(-1.35,-0.95)
SOT-23_L2.9-W1.3-P1.90-LS2.4-BR
  rect 1x0.8 smd: 1(1.15,-0.95) 2(1.15,0.95) 3(-1.15,0)
TYPE-C-SMD_TYPE-C-6P_1
  oval 1.1x1.9 hole 0.6x1.3: 7(-4.32,1.775) 7(-4.32,-2.025) 7(4.32,1.775) 7(4.32,-2.025)
  rect 0.7x1.2 smd: A5(-0.5,2.025) A9(1.5,2.025) B5(0.5,2.025) B9(-1.5,2.025)
  rect 0.8x1.2 smd: A12(2.7,2.025) B12(-2.7,2.025)
X2-DFN2010-8_L2.0-W1.0-P0.50-BL
  rect 0.3x0.6 smd: 1(-0.75,-0.4) 2(-0.25,-0.4) 3(0.25,-0.4) 4(0.75,-0.4) 5(0.75,0.4) 6(0.25,0.4) 7(-0.25,0.4) 8(-0.75,0.4)

## Nets
V5_OUT: C4.1 NOREF#6.TP5 R4.2 U2.A9 U2.B9 U6.5
VIN: C2.2 C11.2 NOREF#4.TP1 R7.2 R20.1 U8.4 U13.A2 U13.A3 U13.B2
VIN_5V: C9.2 C10.1 U1.A9 U1.B9 U13.B3 U13.C2 U13.C3
BATT+: C3.2 L2.1 Q2.3 U6.6
BATT-: C2.1 C3.1 C4.2 C5.1 C6.1 C7.2 C8.2 C9.1 C10.2 C11.1 NOREF#7.TP4 Q3.2 R3.2 R5.2 R14.1 R17.1 R18.2 R19.2 U1.7 U1.A12 U1.B12 U2.7 U2.A12 U2.B12 U6.2 U8.3 U8.9 U9.4 U10.2 U11.2 U12.1 U13.A1 U13.A4 U13.B4 U13.C1 U13.C4
GATE_CTRL: NOREF#10.TP2 Q2.1 R5.1 R6.1 U9.2 U9.3
NOR_QBAR: NOREF#11.TP1 U6.3 U9.6 U9.7
Q2_IN: C5.2 C6.2 C7.1 C8.1 Fuse.1 NOREF#9.TP5 NOREF#13.TP2 Q2.2 R6.2 R12.2 R13.1 R15.1 U8.5 U8.8 U9.8 U10.3 U11.3
RESET: NOREF.TP2 R12.1 U9.5 U10.1
SET: NOREF#8.TP1 Q3.3 R15.2 U9.1
TEMP: R17.2 R20.2 U8.1 U12.3
$1N3839: L2.2 U6.1
$1N3841: R3.1 R4.1 U6.4
$1N4559: Fuse.2 U12.2
$1N8262: LED2_G1.1 U8.6
$1N12165: LED1_R1.1 U8.7
$1N12177: LED1_R1.2 LED2_G1.2 R7.1
$1N16095: Q3.1 R13.2 U11.1
$1N17264: R14.2 U8.2
$1N25253: R18.1 U1.A5
$1N25293: R19.1 U1.B5

Pads without a net: NOREF#2 1; NOREF#3 2; NOREF#5 4; NOREF#12 3; U2 A5 B5; U12 0; U13 B1

## Via types
v1: diameter 0.61, hole 0.305, Top Layer to Bottom Layer, 139 vias

## Routing (per net, layer and track width the routed paths; a pad name or vN(x,y) marks a point on that pad's centre or on a via; arc(x,y) is an arc through that point)
V5_OUT: length 43.5
  Top Layer w0.3: U6.5 41.65,16.48 42.15,15.98 48.45,15.98 C4.1 51.98,14.85 54.08,14.85 55.58,13.35 55.58,11.55 v1(54.68,10.65) ; 52.28,7.84 52.28,6.96 52.27,6.94
  Top Layer w0.5: v1(57.98,6.94) 56.78,8.14 52.58,8.14 52.28,7.84 51.98,8.14 49.88,8.14 49.27,7.53 49.27,6.94 ; v1(62.1,8.36) 62.1,9.63 R4.2
  Bottom Layer w0.5: v1(62.1,8.36) NOREF#6.TP5 61.58,6.94 60.08,6.94 59.18,6.04 58.89,6.04 58.18,6.75 58.11,6.75 54.68,10.18 v1(54.68,10.65)
VIN: length 117.3
  Top Layer w0.181: v1(28.54,12.63) 30.94,10.23 30.94,5.73 29.8,4.59 v1(25.6,4.59) ; v1(7,3.99) 6.83,3.99 C11.2
  Top Layer w0.2: U13.B2 U13.A2 13.25,11.87 U13.A3
  Top Layer w0.3: v1(13.25,13.67) 13.25,13.83 C2.2 3.04,14.57 R7.2 ; v1(18.34,16.83) 18.34,17.29 U8.4 17,16.83 14,16.83 R20.1
  Top Layer w0.4: v1(13.25,13.67) 13.25,11.87
  Bottom Layer w0.181: v1(7,3.99) 7,3.09 8.5,1.59 22.6,1.59 v1(25.6,4.59)
  Bottom Layer w0.5: NOREF#4.TP1 59.44,17.73 27.94,17.73 ; v1(13.25,13.67) 13.84,13.67 14.34,13.17 14.39,13.17 14.43,13.13 15.01,13.13 15.06,13.17 15.08,13.17 16.57,14.66 16.63,14.66 18.34,16.37 v1(18.34,16.83) 19.25,17.73 27.94,17.73 ; 27.94,17.73 28.06,17.61 28.06,14.15 27.89,13.97 27.89,13.39 28.06,13.21 28.06,13.11 v1(28.54,12.63)
VIN_5V: length 28.2
  Top Layer w0.2: U13.B3 U13.C3 U13.C2 13,10.47
  Top Layer w0.3: 14.73,6.94 14.73,6.34 14.13,5.75 12.33,5.75
  Top Layer w0.5: 11.73,6.94 11.73,6.34 12.33,5.75 12.33,4.55 9.15,1.36 5.65,1.36 C10.1 ; 14.73,6.94 14.73,7.55 13,9.27 13,10.47 12.78,10.25 12.02,10.25 11.2,11.07 8.64,11.07
BATT+: length 23.4
  Top Layer w0.3: L2.1 36.01,15.82 36.91,16.72 36.91,17.02 ; 40.59,16.94 40.59,16.64 42.09,15.14 48.69,15.14 v1(48.99,14.84) ; 40.59,16.94 U6.6 ; 40.59,16.94 39.39,16.94 39.09,16.64 37.29,16.64 36.91,17.02 ; C3.2 36.91,17.39 36.91,17.02 ; v1(50.79,14.54) 52.54,12.79 Q2.3
  Bottom Layer w0.5: v1(48.99,14.84) 50.49,14.84 v1(50.79,14.54)
BATT-: length 193.1
  Top Layer w0.181: 12,11.67 v1(12.3,11.97) U13.A1 ; 12,11.67 12,11.17 12.3,10.87 U13.C1 ; 12,11.67 9.44,11.67 C9.1 ; C2.1 v1(13.9,12.17) 13.9,11.77 U13.A4 U13.B4 U13.C4 15.93,8.74 15.93,6.94
  Top Layer w0.3: v1(28.6,13.68) 27.4,12.48 ; 27.4,12.48 30,9.88 30,7.57 ; 27.4,12.48 26.88,11.97 ; U1.7 8.72,6.89 C11.1 5.23,6.99 2.67,6.99 ; U1.7 10.28,6.69 10.53,6.94 ; U1.7 U1.7 ; 49.7,13.92 49.7,15.73 C4.2 ; 49.7,13.92 51.8,11.82 R5.2 51.83,11.5 v1(54,11.5) ; 49.7,13.92 47.04,13.92 Q3.2 44.57,14 43.01,12.44 42.41,12.44 42.11,12.74 ; 48.07,6.64 47.17,7.55 ; 48.07,6.64 48.07,6.94 ; 48.07,6.64 48.97,5.75 52.57,5.75 53.47,6.64 53.47,6.94 53.72,6.69 U2.7 55.36,6.42 55.36,3.17 ; 47.17,7.55 46.89,7.82 U9.4 ; 47.17,7.55 47.17,7.42 U2.7 U2.7 ; 55.36,3.17 56.82,3.17 57.42,3.77 R17.1 59.7,4.54 v1(59.7,7.6) ; 55.36,3.17 U2.7 ; 19.96,14.95 U8.9 ; 19.96,14.95 19.17,15.74 ; 19.96,14.95 23.56,14.95 25.66,17.05 U11.2 29.11,17.49 R14.1 32.15,16.59 32.27,16.59 ; 19.17,15.74 15.07,15.74 C2.1 12.87,15.6 9.44,15.6 C5.1 ; 19.17,15.74 U8.3 ; 4.73,11.58 3.36,11.58 R18.2 0.87,9.09 0.87,7.89 1.77,6.99 2.67,6.99 ; 4.73,11.58 4.78,11.58 R19.2 ; 4.73,11.58 4.73,12.78 5.03,13.08 8.03,13.08 C9.1 ; 2.67,6.99 2.67,5.74 C10.2 ; 42.11,12.74 41.65,13.2 U6.2 ; 42.11,12.74 42.04,12.74 C7.2 ; 38.57,17.65 C3.1 ; 38.57,17.65 37.67,18.55 36.63,18.55 34.07,15.99 33.17,15.99 32.57,16.59 32.27,16.59 ; 38.57,17.65 39.97,17.65 40.27,17.95 51.67,17.95 C6.1 53.17,17.65 56.25,17.65 ; 32.27,16.59 30.86,15.18 ; 56.25,17.65 R3.2 ; 56.25,17.65 56.55,17.65 57.45,18.55 58.35,18.55 63,13.9 v1(63,11.5) ; 30.86,15.18 30.7,15.18 v1(30.4,15.48) ; 30.86,15.18 C8.2 ; U1.7 U1.7 17.3,6.94 15.93,6.94
  Bottom Layer w0.181: v1(12.3,11.97) 12.6,11.97 12.81,12.17 v1(13.9,12.17)
  Bottom Layer w0.3: v1(30.4,15.48) v1(28.6,13.68) ; v1(63,11.5) 62.1,10.6 NOREF#7.TP4 v1(59.7,7.6) 55.8,11.5 v1(54,11.5)
  vias: v1(1.86,6.36) v1(3.36,16.86) v1(3.36,13.86) v1(3.36,12.36) v1(3.36,6.36) v1(4.86,18.36) v1(4.86,16.86) v1(4.86,3.36) v1(6.36,18.36) v1(6.36,13.86) v1(6.36,6.36) v1(7.86,18.36) v1(7.86,15.36) v1(7.86,13.86) v1(7.86,12.36) v1(8.01,7.27) v1(9.36,18.36) v1(9.36,13.86) v1(10.86,18.36) v1(10.86,15.36) v1(10.86,13.86) v1(10.86,12.36) v1(13.35,3.44) v1(13.77,19.11) v1(14.36,16.08) v1(14.85,3.44) v1(15.09,11.74) v1(15.36,15.36) v1(16.35,3.44) v1(16.55,13.64) v1(17.1,11.49) v1(17.8,14.83) v1(19.15,14.03) v1(20.01,7.27) v1(20.59,15.32) v1(21.41,13.75) v1(22.35,3.44) v1(22.86,15.36) v1(22.86,13.86) v1(24.36,15.36) v1(24.36,13.86) v1(25.63,6.64) v1(25.86,16.86) v1(25.86,3.36) v1(25.86,1.86) v1(28.86,10.86) v1(28.86,1.86) v1(30.36,16.86) v1(30.36,12.36) v1(30.36,3.36) v1(31.7,4.63) v1(31.86,15.36) v1(31.86,13.86) v1(31.86,10.86) v1(31.86,1.86) v1(33.36,10.86) v1(33.36,3.36) v1(34.82,18.57) v1(34.86,16.86) v1(34.86,10.86) v1(34.86,1.86) v1(36.36,12.36) v1(37.86,15.36) v1(37.86,13.86) v1(37.86,12.36) v1(37.86,3.36) v1(39.36,15.36) v1(39.36,13.86) v1(39.36,12.36) v1(39.36,1.86) v1(40.86,15.36) v1(40.86,12.36) v1(43.86,12.36) v1(44.63,18.83) v1(45.36,3.36) v1(46.86,10.86) v1(48.36,10.86) v1(48.36,9.36) v1(48.36,4.86) v1(49.86,3.36) v1(51.36,9.36) v1(51.36,4.86) v1(52.86,10.86) v1(52.86,9.36) v1(52.86,3.36) v1(54.36,4.86) v1(57.36,9.36) v1(57.36,4.86) v1(58.86,16.86) v1(58.86,15.36) v1(58.86,7.86) v1(60.36,15.36) v1(60.36,4.86) v1(60.36,3.36) v1(61.86,4.86)
GATE_CTRL: length 71.1
  Top Layer w0.3: 50.22,10.89 51.12,9.99 55.02,9.99 56.22,11.19 ; 50.22,10.89 50.22,11.45 R5.1 ; 50.22,10.89 v1(50.22,9.09) ; R6.1 60.42,6.74 60.42,7.89 57.12,11.19 56.22,11.19 ; v1(40.85,6.32) 41.45,6.32 42.42,7.29 ; 42.42,7.29 44.22,5.49 v1(45.72,5.49) ; 42.42,7.29 U9.2 U9.3 ; 56.22,11.19 56.77,11.74 Q2.1
  Bottom Layer w0.3: v1(45.72,5.49) 46.02,5.19 46.62,5.19 50.22,8.79 v1(50.22,9.09) ; NOREF#10.TP2 3.57,8.2 26.97,8.2 28.85,6.32 v1(40.85,6.32)
NOR_QBAR: length 57.4
  Top Layer w0.3: 43.32,9.52 42.72,8.92 ; 43.32,9.52 43.32,11.02 v1(42.72,11.62) ; 43.32,9.52 44.06,9.52 44.96,8.62 v1(46.62,8.62) ; 42.72,8.92 42.72,8.82 U9.6 ; 42.72,8.92 U9.7 ; v1(42.72,13.12) 42.72,14.12 U6.3
  Bottom Layer w0.3: v1(46.62,8.62) 43.36,5.36 8.37,5.36 6.27,7.46 NOREF#11.TP1 ; v1(42.72,11.62) v1(42.72,13.12)
Q2_IN: length 122
  Top Layer w0.3: R15.1 5.89,17.3 C5.2 9.91,16.54 v1(12.02,16.54) ; R12.2 62.1,12.68 v1(62.1,13.44) ; 26.36,15.94 U11.3 ; 18.8,5.02 v1(18.41,4.62) ; 18.8,5.02 18.8,7.72 17.9,8.62 U8.5 18.02,12.04 18.02,12.34 ; 18.8,5.02 18.8,4.52 R13.1 ; 56.77,14.04 Q2.2 ; 56.77,14.04 55.17,15.65 C6.2 ; 56.77,14.04 v1(57.3,14.57) ; 21.86,12.04 U8.8 ; v1(42,10.97) 42,10.37
  Top Layer w0.5: Fuse.1 42.91,3.08 42.91,3.11 40.13,5.89 40.13,7.73 41.13,8.73 41.76,8.73 ; R6.2 62.99,7.72 62.99,9.11 63.02,9.15 63.02,10.34 62.99,10.38 62.99,10.51 62.29,11.21 62.29,11.27 62.09,11.47 R12.2 ; 24.56,12.04 21.86,12.04 20.96,12.94 18.62,12.94 18.02,12.34 16.22,12.34 v1(14.72,13.84) ; 24.56,12.04 24.56,11.16 U10.3 ; 24.56,12.04 24.56,12.64 26.36,14.44 26.36,15.94 29.36,15.94 29.66,15.64 29.66,14.38 30.79,13.24 C8.1 31.05,13.05 31.98,13.05 32.08,13.15 32.66,13.15 32.76,13.05 33.59,13.05 33.72,13.18 34.31,13.18 34.44,13.05 34.44,13.05 36.35,11.14 C7.1 39.05,10.83 39.8,10.07 41.7,10.07 42,10.37 42,9.45 41.92,9.37 41.92,9.14
  Bottom Layer w0.5: v1(18.41,4.62) 8.21,4.62 7.91,4.92 NOREF#9.TP5 ; NOREF#13.TP2 v1(62.1,13.44) 61.8,13.74 58.43,13.74 57.6,14.57 v1(57.3,14.57) 56.56,13.83 42.18,13.83 42,13.65 v1(42,10.97) ; v1(14.72,13.84) v1(12.02,16.54)
RESET: length 64.1
  Top Layer w0.3: v1(26,10.07) 28.38,10.07 v1(28.99,9.47) ; v1(58.9,12.82) 60.43,12.82 R12.1 ; v1(43.9,8.62) U9.5
  Bottom Layer w0.3: v1(28.99,9.47) 42.75,9.47 43.6,8.62 v1(43.9,8.62) 43.9,11.02 45.7,12.82 v1(58.9,12.82) ; v1(26,10.07) 4.25,10.07 NOREF.TP2
SET: length 54.9
  Top Layer w0.3: R15.2 5.67,15.68 v1(2.97,15.68) ; v1(44.97,9.86) Q3.3 ; v1(41.43,7.82) U9.1
  Bottom Layer w0.3: NOREF#8.TP1 2.37,15.68 v1(2.97,15.68) 7.77,10.88 26.37,10.88 29.43,7.82 v1(41.43,7.82) 44.13,7.82 44.97,8.66 v1(44.97,9.86)
TEMP: length 60.1
  Top Layer w0.3: 21.71,17.87 22.91,19.07 32.51,19.07 33.71,17.87 v1(33.71,16.67) ; 21.71,17.87 20.81,18.77 15.37,18.77 R20.2 ; 21.71,17.87 U8.1 ; R17.2 58.02,1.36 42.61,1.36 42.31,1.66 42.31,2.86 37.6,7.57 34,7.57 34.01,7.58 v1(34.01,12.47)
  Bottom Layer w0.3: v1(33.71,16.67) 34.01,16.37 v1(34.01,12.47)
$1N3839: length 7.6
  Top Layer w0.3: U6.1 39.58,13.12 35.28,13.12 L2.2
$1N3841: length 24.7
  Top Layer w0.3: 58.01,16.95 58.01,12.45 R4.1 ; 58.01,16.95 57.71,16.65 54.11,16.65 v1(53.81,16.95) ; 58.01,16.95 58.01,17.51 R3.1 ; v1(47.51,16.95) 42.61,16.95 U6.4
  Bottom Layer w0.3: v1(53.81,16.95) v1(47.51,16.95)
$1N4559: length 11.1
  Top Layer w0.5: Fuse.2 37.81,5.29 33.33,5.29 32,6.62 32,7.57
$1N8262: length 10.7
  Top Layer w0.3: U8.6 19.31,11.78 19.31,5.5 LED2_G1.1
$1N12165: length 6.3
  Top Layer w0.3: 20.44,11.92 20.44,8.36 22.36,6.44
$1N12177: length 32.2
  Top Layer w0.3: R7.1 0.84,13.89 0.84,12.45 v1(2.04,11.25) ; LED2_G1.2 23.91,6.4 LED1_R1.2 v1(21.16,9.15)
  Bottom Layer w0.3: v1(21.16,9.15) 4.44,9.15 2.34,11.25 v1(2.04,11.25)
$1N16095: length 46.9
  Top Layer w0.3: R13.2 20.17,1.65 24.46,1.65 24.76,1.95 24.76,7.65 ; v1(28.96,7.35) 28.66,7.65 24.76,7.65 ; v1(46.12,12.1) Q3.1 ; 24.76,7.65 24.46,7.95 24.46,9.45 25.36,10.35 25.36,11.85 U11.1
  Bottom Layer w0.3: v1(28.96,7.35) 29.26,7.05 44.32,7.05 45.82,8.55 45.82,11.8 v1(46.12,12.1)
$1N17264: length 14
  Top Layer w0.3: 20.44,17.73 20.44,17.49 21.34,16.59 24.34,16.59 26.14,18.39 31.85,18.39 R14.2
$1N25253: length 11.9
  Top Layer w0.3: 12.73,6.94 12.73,7.55 11.79,8.48 R18.1
$1N25293: length 10.7
  Top Layer w0.3: R19.1 7.62,10.25 11.03,10.25 13.73,7.55 13.73,6.94

## Copper pours and planes (outline as drawn; the poured copper is in the pictures)
BATT- on Top Layer: 0,20 64,20 64,0 0,0
BATT- on Bottom Layer: 0,20 64,20 64,0.09 0,0.09

## Text on the board
Bottom Silkscreen Layer: RESET | SET | GATE | QBAR | Q2_IN | VIN_5v | BATT+ | BATT- | VOUT
Top Silkscreen Layer: Charging | Done | CHARGE(IN) | Battery | DISPLAY(OUT)

# Board PCB3
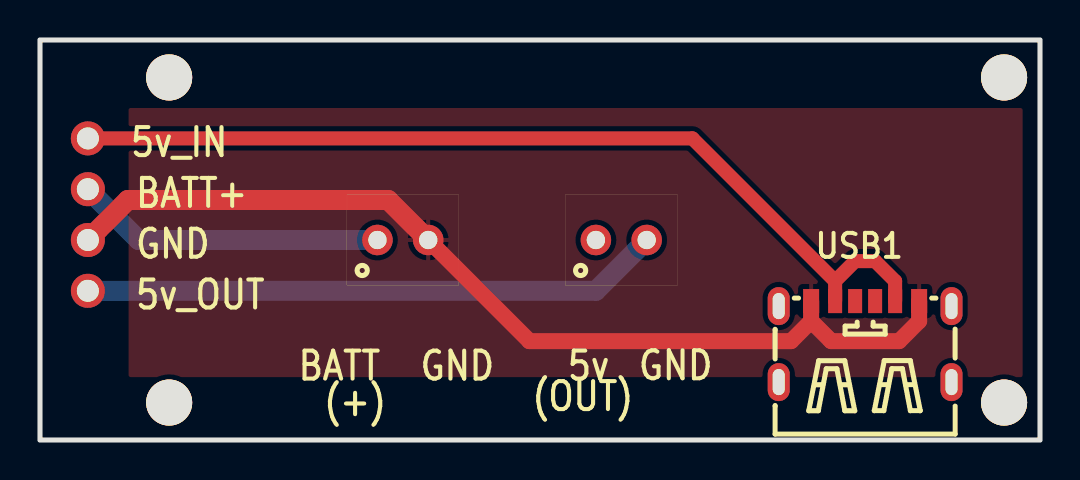
[diagram p4: board, top side]
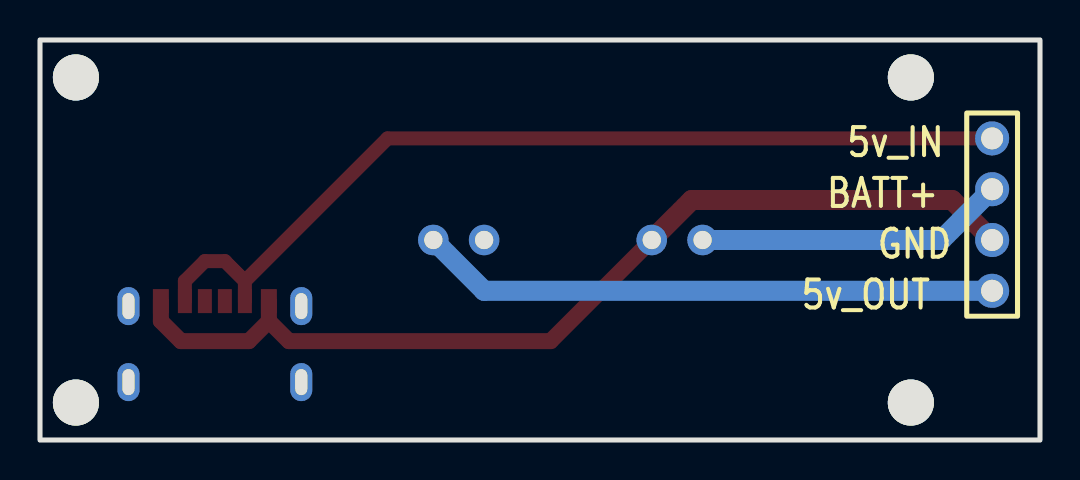
[diagram p5: board, bottom side, seen from below]

Outline 50 x 20 mm; copper layers: Top Layer, Bottom Layer. Coordinates in mm from the lower left corner of the outline.
Outline path: rectangle 0,20 50,0
Stack: Top Layer 0.035mm / Dielectric1 1.51mm FR4 er 4.5 / Bottom Layer 0.035mm

## Design rules (mm)
template: Custom Config
spacing copperThickness1oz (default): track to track 0.5, other pairs 0.152 to 0.3
spacing copperThickness2oz: track to track 0.203, other pairs 0.152 to 0.3
track width copperThickness1oz (default): min 0.127, default 0.254, max 2.54
track width copperThickness2oz: min 0.203, default 1, max 2.54
differential pair differentialPair (default): width min 0.127, default 0.254, max 2.54; gap min 0.152, default 0.152
via viaSize (default): diameter min 0.5, default 0.61, max 10; hole min 0.3, default 0.305, max 6.3
net GND uses copperThickness2oz
net BATT+ uses copperThickness2oz
net OUT_5V uses copperThickness2oz
net PROG uses copperThickness2oz
net +5V uses copperThickness2oz

## Placement (name value [footprint] x y rotation side)
NOREF  -  [Pad_e7]  6.46 1.87 0 top
NOREF#2  -  [Pad_e9]  48.21 18.13 0 top
NOREF#3  -  [Pad_e10]  48.21 1.87 0 top
NOREF#4  -  [Pad_e2]  6.46 18.13 0 top
POGO1  -  [4-pin Pogo]  2.39 11.27 180 bottom
U2  3v IN  [2p]  18.14 10 90 top
U3  P_5v_OUT  [2p]  29.06 10 90 top
USB1  5v Fixed  [TYPE-C-SMD_TYPE-C-6P_1]  41.26 4.92 0 top

## Footprints (pads in the part's own frame, mm; a bottom-side part is the same pattern mirrored in y, then rotated)
2p
  round 1.524 hole 0.914: 1(0,1.27) 2(0,-1.27)
4-pin Pogo
  round 1.7 hole 1.1: 1(0,3.81) 2(0,1.27) 3(0,-1.27) 4(0,-3.81)
Pad_e2
  round 2.3 hole 2.3: 1(0,0)
Pad_e7
  round 2.3 hole 2.3: 2(0,0)
Pad_e9
  round 2.3 hole 2.3: 3(0,0)
Pad_e10
  round 2.3 hole 2.3: 4(0,0)
TYPE-C-SMD_TYPE-C-6P_1
  oval 1.1x1.9 hole 0.6x1.3: 7(-4.32,1.775) 7(-4.32,-2.025) 7(4.32,1.775) 7(4.32,-2.025)
  rect 0.7x1.2 smd: A5(-0.5,2.025) A9(1.5,2.025) B5(0.5,2.025) B9(-1.5,2.025)
  rect 0.8x1.2 smd: A12(2.7,2.025) B12(-2.7,2.025)

## Nets
+5V: POGO1.1 USB1.A9 USB1.B9
GND: POGO1.3 U2.2 USB1.A12 USB1.B12
BATT+: POGO1.2 U2.1
OUT_5V: POGO1.4 U3.2
PROG: U3.1

Pads without a net: NOREF 2; NOREF#2 3; NOREF#3 4; NOREF#4 1; USB1 7 A5 B5

## Routing (per net, layer and track width the routed paths; a pad name or vN(x,y) marks a point on that pad's centre or on a via; arc(x,y) is an arc through that point)
+5V: length 46.1
  Top Layer w0.7: 42.76,6.94 42.76,7.94 41.76,8.94 40.76,8.94 39.76,7.94 ; 39.76,6.94 39.76,7.94 ; 39.76,7.94 32.62,15.08 POGO1.1
GND: length 48.6
  Top Layer w0.8: 38.56,5.94 39.56,4.94 42.96,4.94 43.96,5.94 43.96,6.94 ; 38.56,5.94 37.56,4.94 24.47,4.94 U2.2 ; 38.56,5.94 38.56,6.94
  Top Layer w1: U2.2 17.41,12 4.39,12 POGO1.3
BATT+: length 15.5
  Bottom Layer w1: POGO1.2 4.93,10 U2.1
OUT_5V: length 29
  Bottom Layer w1: U3.2 27.79,7.46 POGO1.4

## Copper pours and planes (outline as drawn; the poured copper is in the pictures)
GND on Top Layer: 4.43,16.6 49.13,16.6 49.13,3.14 4.43,3.14

## Text on the board
Bottom Silkscreen Layer: GND | 5v_IN | BATT+ | 5v_OUT
Top Silkscreen Layer: 5v_IN | BATT+ | GND | 5v_OUT | BATT | (+) | (OUT) | 5v
